# EAGLE design controller-right (EAGLE 8.6.0)
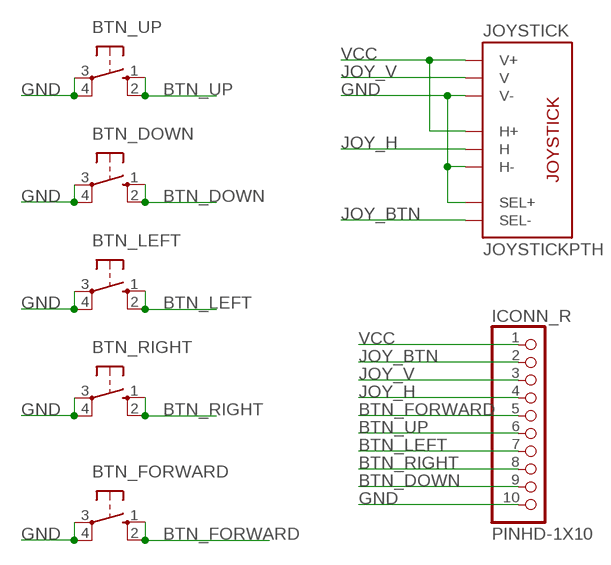
[diagram p0: schematic, sheet 1]

## Parts
BTN_DOWN  40-XX-ROUND  [B3F-40XX-ROUND]
BTN_FORWARD  40-XX-ROUND  [B3F-40XX-ROUND]
BTN_LEFT  40-XX-ROUND  [B3F-40XX-ROUND]
BTN_RIGHT  40-XX-ROUND  [B3F-40XX-ROUND]
BTN_UP  40-XX-ROUND  [B3F-40XX-ROUND]
ICONN_R  PINHD-1X10  [1X10-BIG]
JOYSTICK  JOYSTICKPTH  [JOYSTICK]

## Nets
BTN_DOWN: BTN_DOWN.1(S) BTN_DOWN.2(S1) ICONN_R.9
BTN_FORWARD: BTN_FORWARD.1(S) BTN_FORWARD.2(S1) ICONN_R.5
BTN_LEFT: BTN_LEFT.1(S) BTN_LEFT.2(S1) ICONN_R.7
BTN_RIGHT: BTN_RIGHT.1(S) BTN_RIGHT.2(S1) ICONN_R.8
BTN_UP: BTN_UP.1(S) BTN_UP.2(S1) ICONN_R.6
GND: BTN_DOWN.3(P) BTN_DOWN.4(P1) BTN_FORWARD.3(P) BTN_FORWARD.4(P1) BTN_LEFT.3(P) BTN_LEFT.4(P1) BTN_RIGHT.3(P) BTN_RIGHT.4(P1) BTN_UP.3(P) BTN_UP.4(P1) ICONN_R.10 JOYSTICK.B1A(SEL+) JOYSTICK.H3(H-) JOYSTICK.V3(V-)
JOY_BTN: ICONN_R.2 JOYSTICK.B2A(SEL-)
JOY_H: ICONN_R.4 JOYSTICK.H2(H)
JOY_V: ICONN_R.3 JOYSTICK.V2(V)
VCC: ICONN_R.1 JOYSTICK.H1(H+) JOYSTICK.V1(V+)

## Library data of the parts
BTN_DOWN BTN_FORWARD BTN_LEFT BTN_RIGHT BTN_UP = adafruit:40-XX: OMRON SWITCH
ICONN_R = adafruit:PINHD-1X10: Pin header 1x10 0.1" spacing With round pins
JOYSTICK = adafruit:JOYSTICK: Thumb Joystick Joystick commonly found in PS2 controllers. Two pots and a select switch. Adapted from Sparkfun Library (but for more common 6mm switch sticks)

## Board
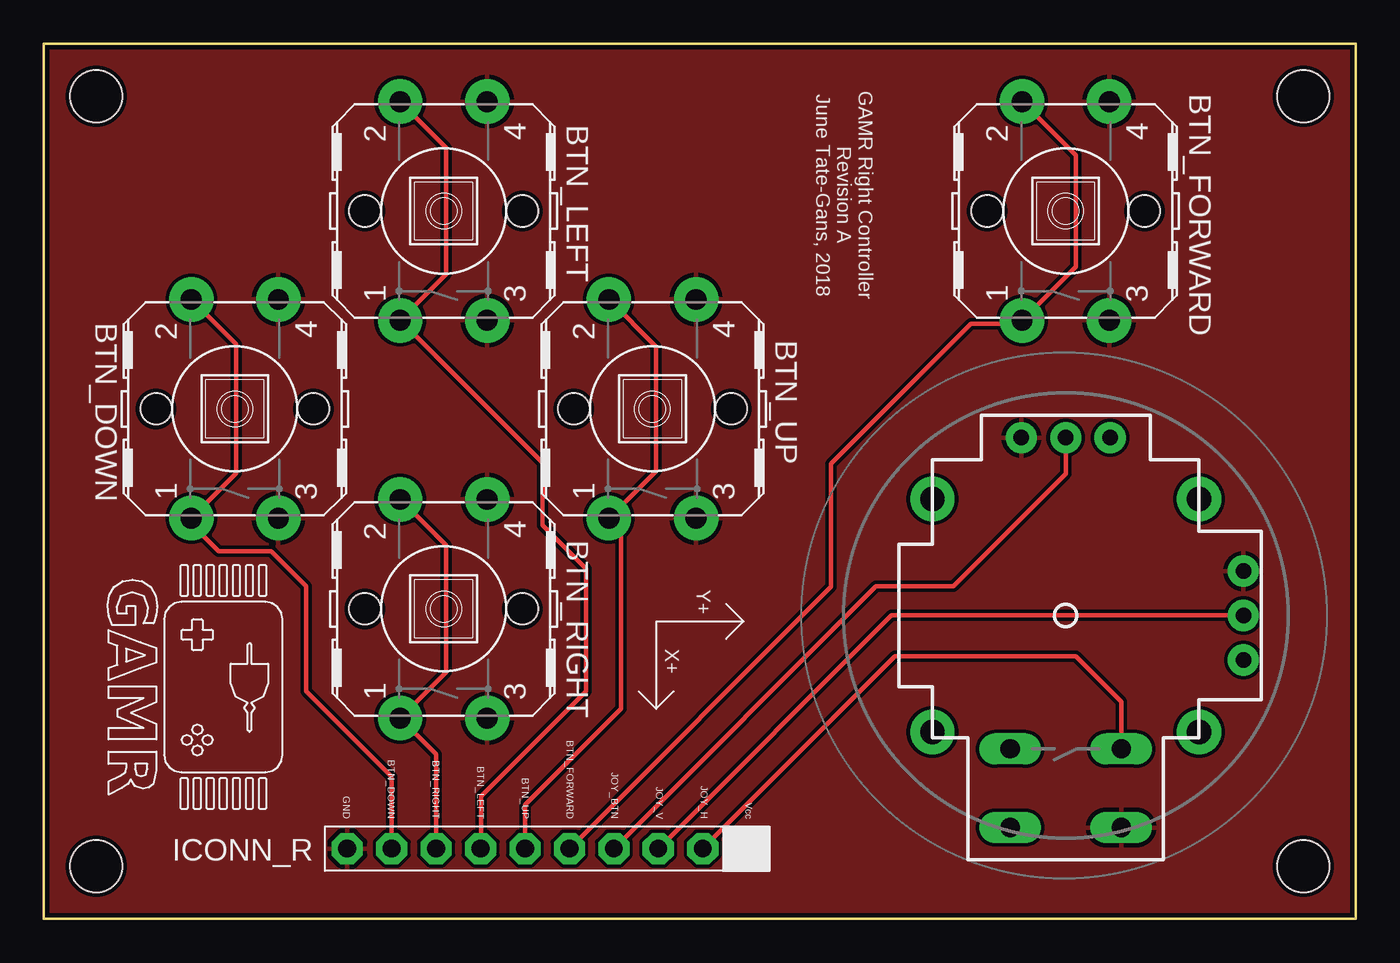
[diagram p1: board, top side]
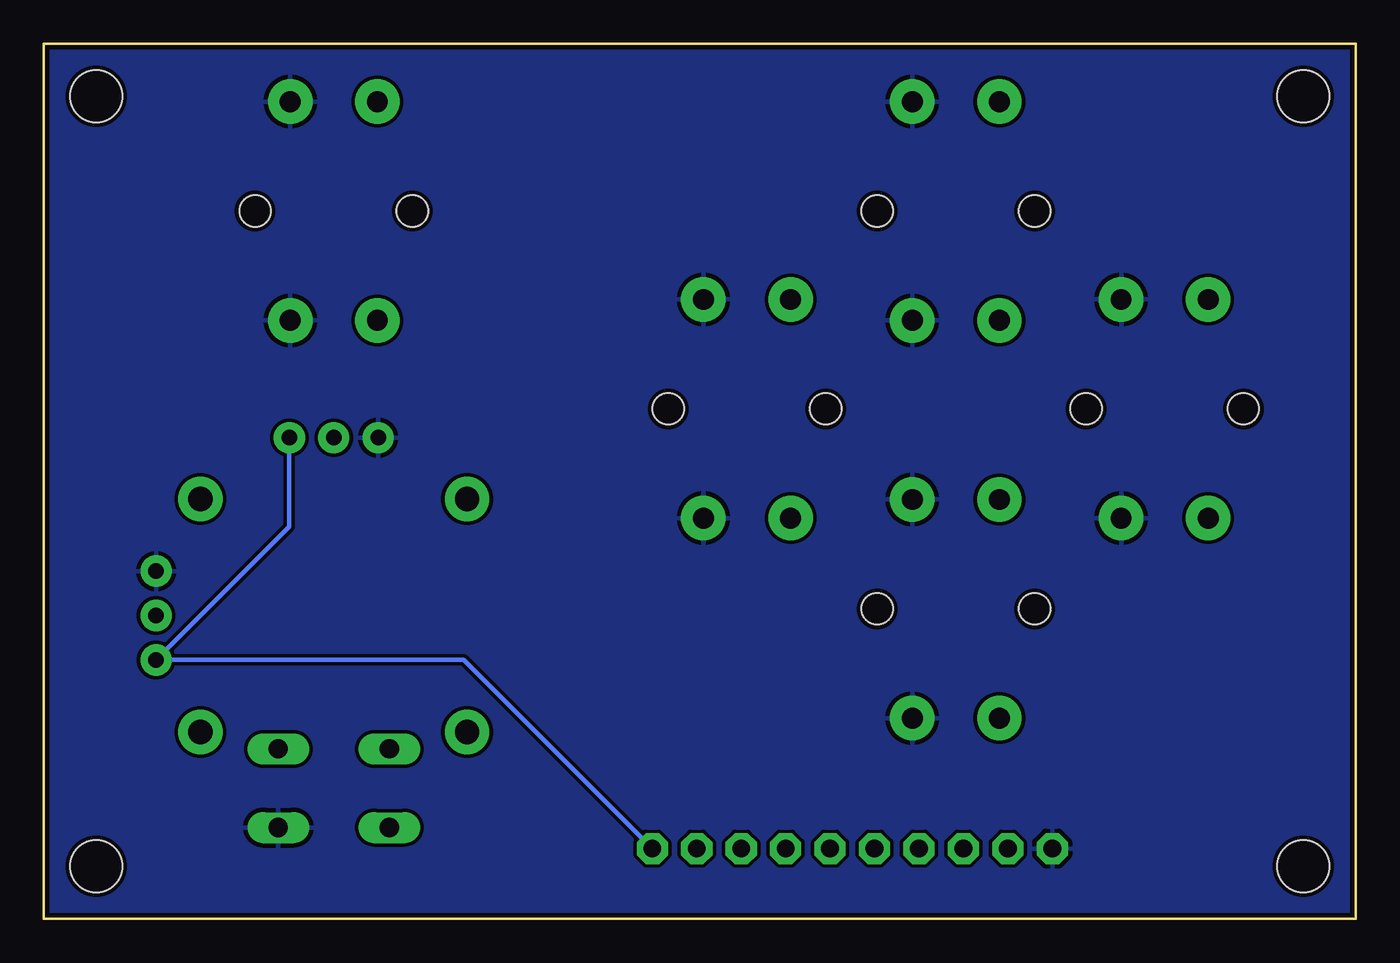
[diagram p2: board, bottom side, seen from below]

Size 75 x 50 mm. Coordinates in mm from the lower left corner, seen from the top.
Outline: 0,0 75,0 75,50 0,50 0,0
Copper layers (1*16): Top 0.035mm / dielectric 1.5mm / Bottom 0.035mm
Design rules "SparkFun": minimum track width 8mil, minimum drill 20mil, track to track 8mil, track to pad 8mil, pad to pad 8mil, via to via 8mil, smd to smd 8mil, copper to edge 10mil, drill to drill 8mil, minimum pad ring 12mil, minimum via ring 10mil, stop-mask expansion 4mil, vias tented up to drill 25mil, thermal gap 10mil
Holes 3 mm at 3,3 3,47 72,47 72,3

### Footprints (pad centres in the part's own frame; a part is rotated, then mirrored left to right if it is on the bottom)
B3F-40XX-ROUND = drill 1.194 pad 2.54: 1 -6.248,2.489; 2 6.248,2.489; 3 -6.248,-2.489; 4 6.248,-2.489 | hole 1.803: 0,-4.496; 0,4.496
1X10-BIG = drill 1.016 pad 1.778 octagon: 1 -11.43,0; 2 -8.89,0; 3 -6.35,0; 4 -3.81,0; 5 -1.27,0; 6 1.27,0; 7 3.81,0; 8 6.35,0; 9 8.89,0; 10 11.43,0
JOYSTICK = drill 1.1 pad 1.778 long: B1A -3.175,12.12; B1B 3.175,12.12; B2A -3.175,7.62; B2B 3.175,7.62 | drill 0.889 pad 1.778: H1 -2.54,-10.16; H2 0,-10.16; H3 2.54,-10.16; V1 -10.16,2.54; V2 -10.16,0; V3 -10.16,-2.54 | drill 1.397 pad 2.54: MOUNT1 -7.62,6.668; MOUNT2 -7.62,-6.668; MOUNT3 7.62,-6.668; MOUNT4 7.62,6.668

### Placement (x,y rotation side)
BTN_DOWN  10.92,29.14 90 top
BTN_FORWARD  58.42,40.44 90 top
BTN_LEFT  22.86,40.44 90 top
BTN_RIGHT  22.86,17.71 90 top
BTN_UP  34.8,29.14 90 top
ICONN_R  28.78,4.01 180 top
JOYSTICK  58.42,17.33 180 top

### Tracks (layer width: path | path; a pad name or v marks a point on that pad's centre or on a via)
BTN_DOWN
  Top 0.254: BTN_DOWN.2 11,32.82 11,25.46 BTN_DOWN.1 8.43,22.57 10,21 13,21 15,19 15,13 19.89,8.11 ICONN_R.9
BTN_FORWARD
  Top 0.254: ICONN_R.5 45,18.96 45,26 53,34 55.74,34 BTN_FORWARD.1 59,37.26 59,43.62 BTN_FORWARD.2
BTN_LEFT
  Top 0.254: BTN_LEFT.2 23,44.06 23,36.82 BTN_LEFT.1 28.5,26.07 28.5,22.5 31,20 31,13 25,7 25,4.04 ICONN_R.7
BTN_RIGHT
  Top 0.254: BTN_RIGHT.2 23,21.33 23,14.09 BTN_RIGHT.1 22.43,9.4 ICONN_R.8
BTN_UP
  Top 0.254: BTN_UP.2 35,32.7 35,25.58 BTN_UP.1 33,22.2 33,12 27.51,6.51 ICONN_R.6
GND
  pour Bottom (isolate 0.012): 0,50 0,0 75,0 75,50
  pour Top (isolate 0.012): 0,50 75,50 75,0 0,0
JOY_BTN
  Top 0.254: ICONN_R.2 48.66,15 59,15 61.59,12.4 JOYSTICK.B2A
JOY_H
  Top 0.254: ICONN_R.4 47.58,19 52,19 58.42,25.42 JOYSTICK.H2
JOY_V
  Top 0.254: ICONN_R.3 48.45,17.33 JOYSTICK.V2
VCC
  Bottom 0.254: ICONN_R.1 50.99,14.79 JOYSTICK.V1 60.96,22.41 JOYSTICK.H1

### Text on the board
tPlace: GAMR Right Controller / Revision A / June Tate-Gans, 2018 | Y+ | X+ | GND | BTN_DOWN | BTN_RIGHT | BTN_LEFT | BTN_UP | BTN_FORWARD | JOY_BTN | JOY_V | JOY_H | Vcc